# Altium schematic sheet ArtixBank34.SchDoc
size A
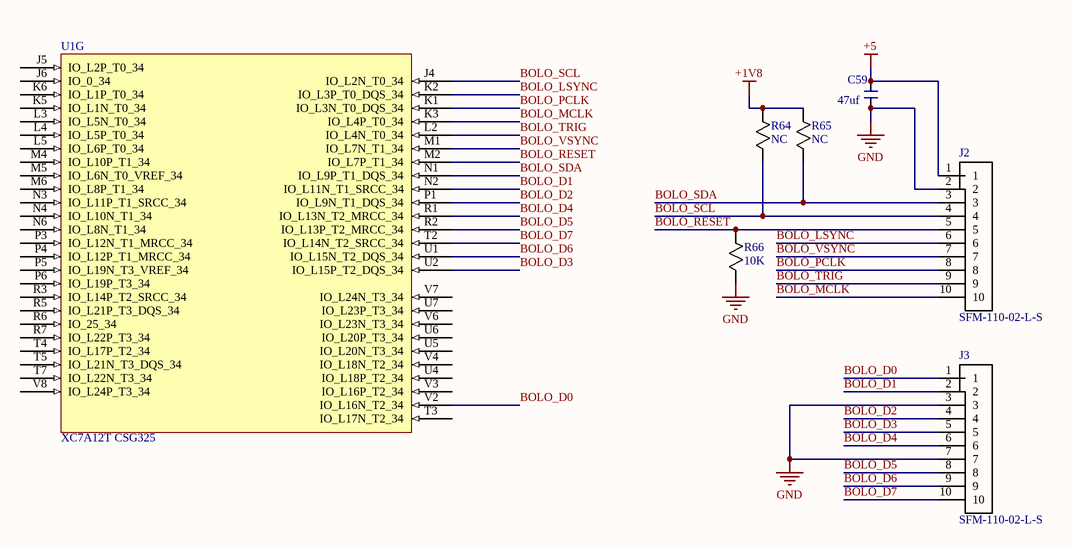
[diagram p0: ArtixBank34.SchDoc]

## Parts
C59  47uf  [0805FOOTPRINT]
J2  SFM-110-02-L-S  [SFM-110-02-L-S]
J3  SFM-110-02-L-S  [SFM-110-02-L-S]
R64  NC  [RES_CRCW_0402]
R65  NC  [RES_CRCW_0402]
R66  10K  [RES_CRCW_0402]
U1  XC7A12T CSG325  [BGA324C80P18X18_1500X1500X150]  (part G of 7)

## Nets
+1V8: R64.1 R65.1
+5: C59.1 J2.1
GND: C59.2 J2.2 J3.3 J3.7 R66.2
BOLO_D0: J3.1 U1.V2(IO_L16N_T2_34)
BOLO_D1: J3.2 U1.N2(IO_L11N_T1_SRCC_34)
BOLO_D2: J3.4 U1.P1(IO_L9N_T1_DQS_34)
BOLO_D3: J3.5 U1.U2(IO_L15P_T2_DQS_34)
BOLO_D4: J3.6 U1.R1(IO_L13N_T2_MRCC_34)
BOLO_D5: J3.8 U1.R2(IO_L13P_T2_MRCC_34)
BOLO_D6: J3.9 U1.U1(IO_L15N_T2_DQS_34)
BOLO_D7: J3.10 U1.T2(IO_L14N_T2_SRCC_34)
BOLO_LSYNC: J2.6 U1.K2(IO_L3P_T0_DQS_34)
BOLO_MCLK: J2.10 U1.K3(IO_L4P_T0_34)
BOLO_PCLK: J2.8 U1.K1(IO_L3N_T0_DQS_34)
BOLO_RESET: J2.5 R66.1 U1.M2(IO_L7P_T1_34)
BOLO_SCL: J2.4 R64.2 U1.J4(IO_L2N_T0_34)
BOLO_SDA: J2.3 R65.2 U1.N1(IO_L9P_T1_DQS_34)
BOLO_TRIG: J2.9 U1.L2(IO_L4N_T0_34)
BOLO_VSYNC: J2.7 U1.M1(IO_L7N_T1_34)

Not connected (* = marked no-connect by the designer): U1 J5(IO_L2P_T0_34) J6(IO_0_34) K5(IO_L1N_T0_34) K6(IO_L1P_T0_34) L3(IO_L5N_T0_34) L4(IO_L5P_T0_34) L5(IO_L6P_T0_34) M4(IO_L10P_T1_34) M5(IO_L6N_T0_VREF_34) M6(IO_L8P_T1_34) N3(IO_L11P_T1_SRCC_34) N4(IO_L10N_T1_34) N6(IO_L8N_T1_34) P3(IO_L12N_T1_MRCC_34) P4(IO_L12P_T1_MRCC_34) P5(IO_L19N_T3_VREF_34) P6(IO_L19P_T3_34) R3(IO_L14P_T2_SRCC_34) R5(IO_L21P_T3_DQS_34) R6(IO_25_34) R7(IO_L22P_T3_34) T3(IO_L17N_T2_34) T4(IO_L17P_T2_34) T5(IO_L21N_T3_DQS_34) T7(IO_L22N_T3_34) U4(IO_L18P_T2_34) U5(IO_L20N_T3_34) U6(IO_L20P_T3_34) U7(IO_L23P_T3_34) V3(IO_L16P_T2_34) V4(IO_L18N_T2_34) V6(IO_L23N_T3_34) V7(IO_L24N_T3_34) V8(IO_L24P_T3_34)

## Library data of the parts
C59 = 47uf_0805: 0805; Manufacturer 1: *; Manufacturer Part Number 1: *
R64 R65 = NC_0402: Manufacturer 1: *; Manufacturer Part Number 1: *
R66 = 10K_0402: 0402; Manufacturer Part Number 1: CRCW040210K0FKED; Tolerance: 1%; Manufacturer 1: *
U1 = XC7A12T_1CSG325I